# EAGLE design Isolated-ARD (EAGLE 6.3)

## Sheet 1 of 5: Voltage/Signal Input
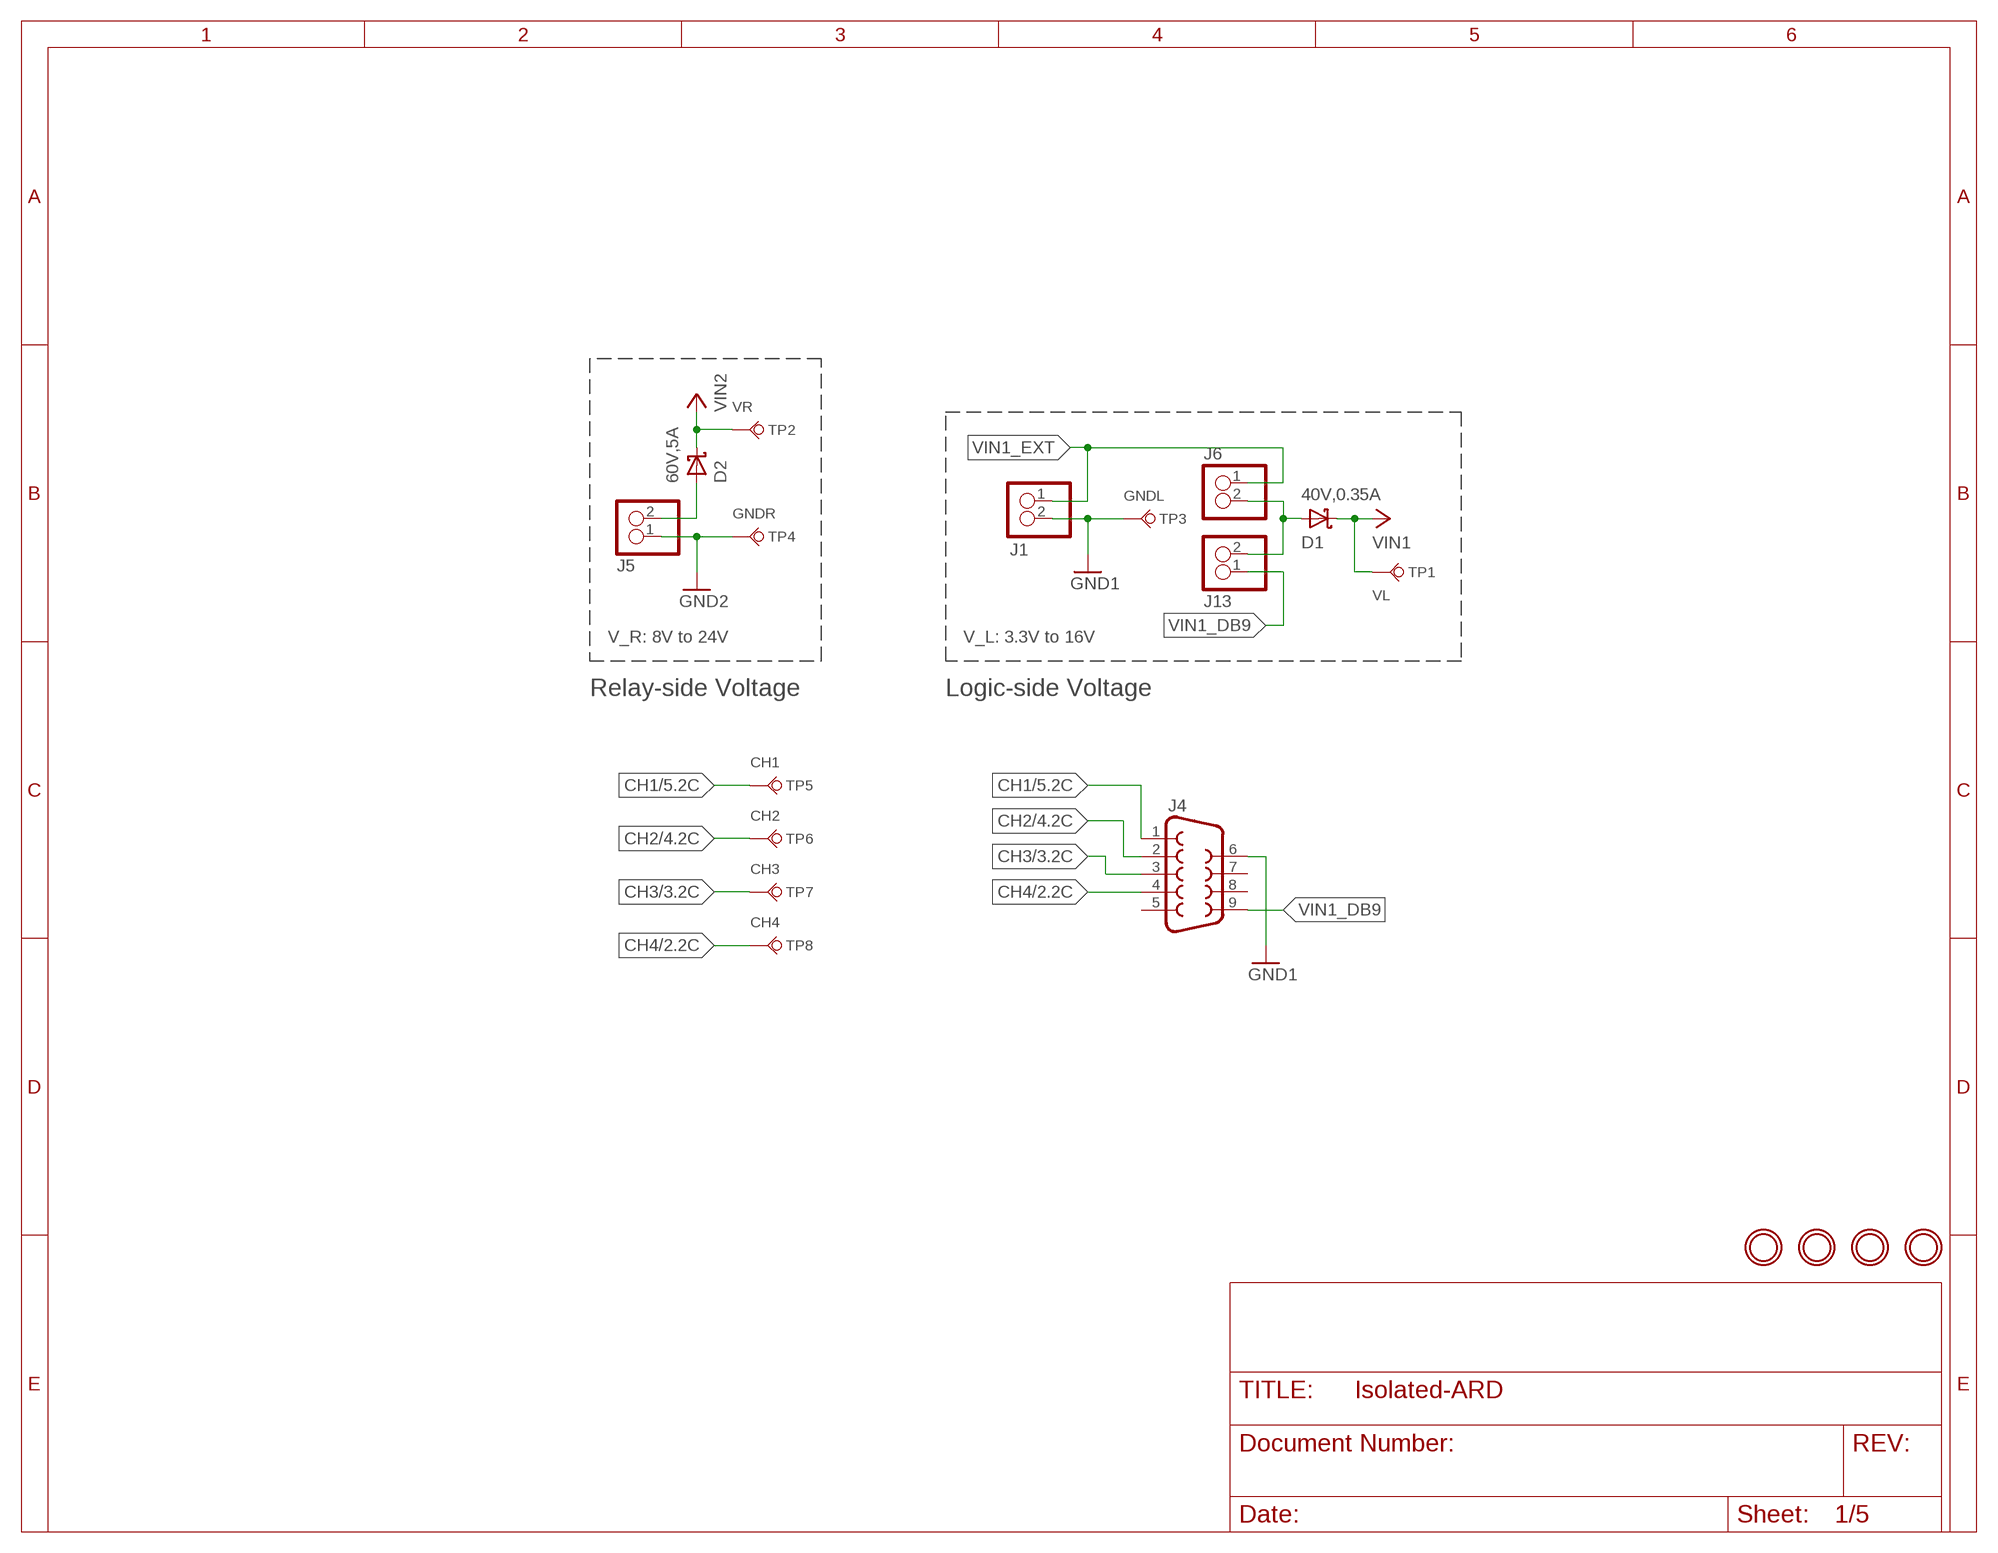
[diagram p0: schematic, sheet 1]

### Parts
D1  40V,0.35A  SD103AWS-7-F  [SOD-323]
D2  60V,5A  B560C-13-F  [SMC-DIODE]
J1  M02SKT-3.5MM-R90  [SOCKET-3.5MM-2-R90]
J4  DB9-R90-F  [DB9-R90]
J5  M02SKT-3.5MM-R90  [SOCKET-3.5MM-2-R90]
J6  M02SQ1  [1X02_SQ1]
J13  M02SQ1  [1X02_SQ1]
TP1  TP-THRU-R  [TP_THRU_CIRC]
TP2  TP-THRU-R  [TP_THRU_CIRC]
TP3  TP-THRU-B  [TP_THRU_CIRC]
TP4  TP-THRU-B  [TP_THRU_CIRC]
TP5  TP-THRU-B  [TP_THRU_CIRC]
TP6  TP-THRU-B  [TP_THRU_CIRC]
TP7  TP-THRU-B  [TP_THRU_CIRC]
TP8  TP-THRU-B  [TP_THRU_CIRC]
U$13  MNTHOLE-M3  [MNTHOLE_M3_PLATED]
U$14  MNTHOLE-M3  [MNTHOLE_M3_PLATED]
U$15  MNTHOLE-M3  [MNTHOLE_M3_PLATED]
U$21  MNTHOLE-M3  [MNTHOLE_M3_PLATED]

### Nets
CH1: J4.1 TP5.TP ; also sheet 5
CH2: J4.2 TP6.TP ; also sheet 4
CH3: J4.3 TP7.TP ; also sheet 3
CH4: J4.4 TP8.TP ; also sheet 2
GND1: J1.2 J4.6 TP3.TP ; also sheet 2,3,4,5
GND2: J5.1 TP4.TP ; also sheet 2,3,4,5
N$9: D1.A J6.2 J13.2
VIN1: D1.C TP1.TP ; also sheet 2,3,4,5
VIN1_DB9: J4.9 J13.1
VIN1_EXT: J1.1 J6.1
VIN2: D2.C TP2.TP ; also sheet 2,3,4,5
VIN2_EXT: D2.A J5.2
Unconnected: J4.5 J4.7 J4.8

### Notes on the sheet
- V_R: 8V to 24V | V_L: 3.3V to 16V
- Relay-side Voltage | Logic-side Voltage

## Sheet 2 of 5: Channel 1
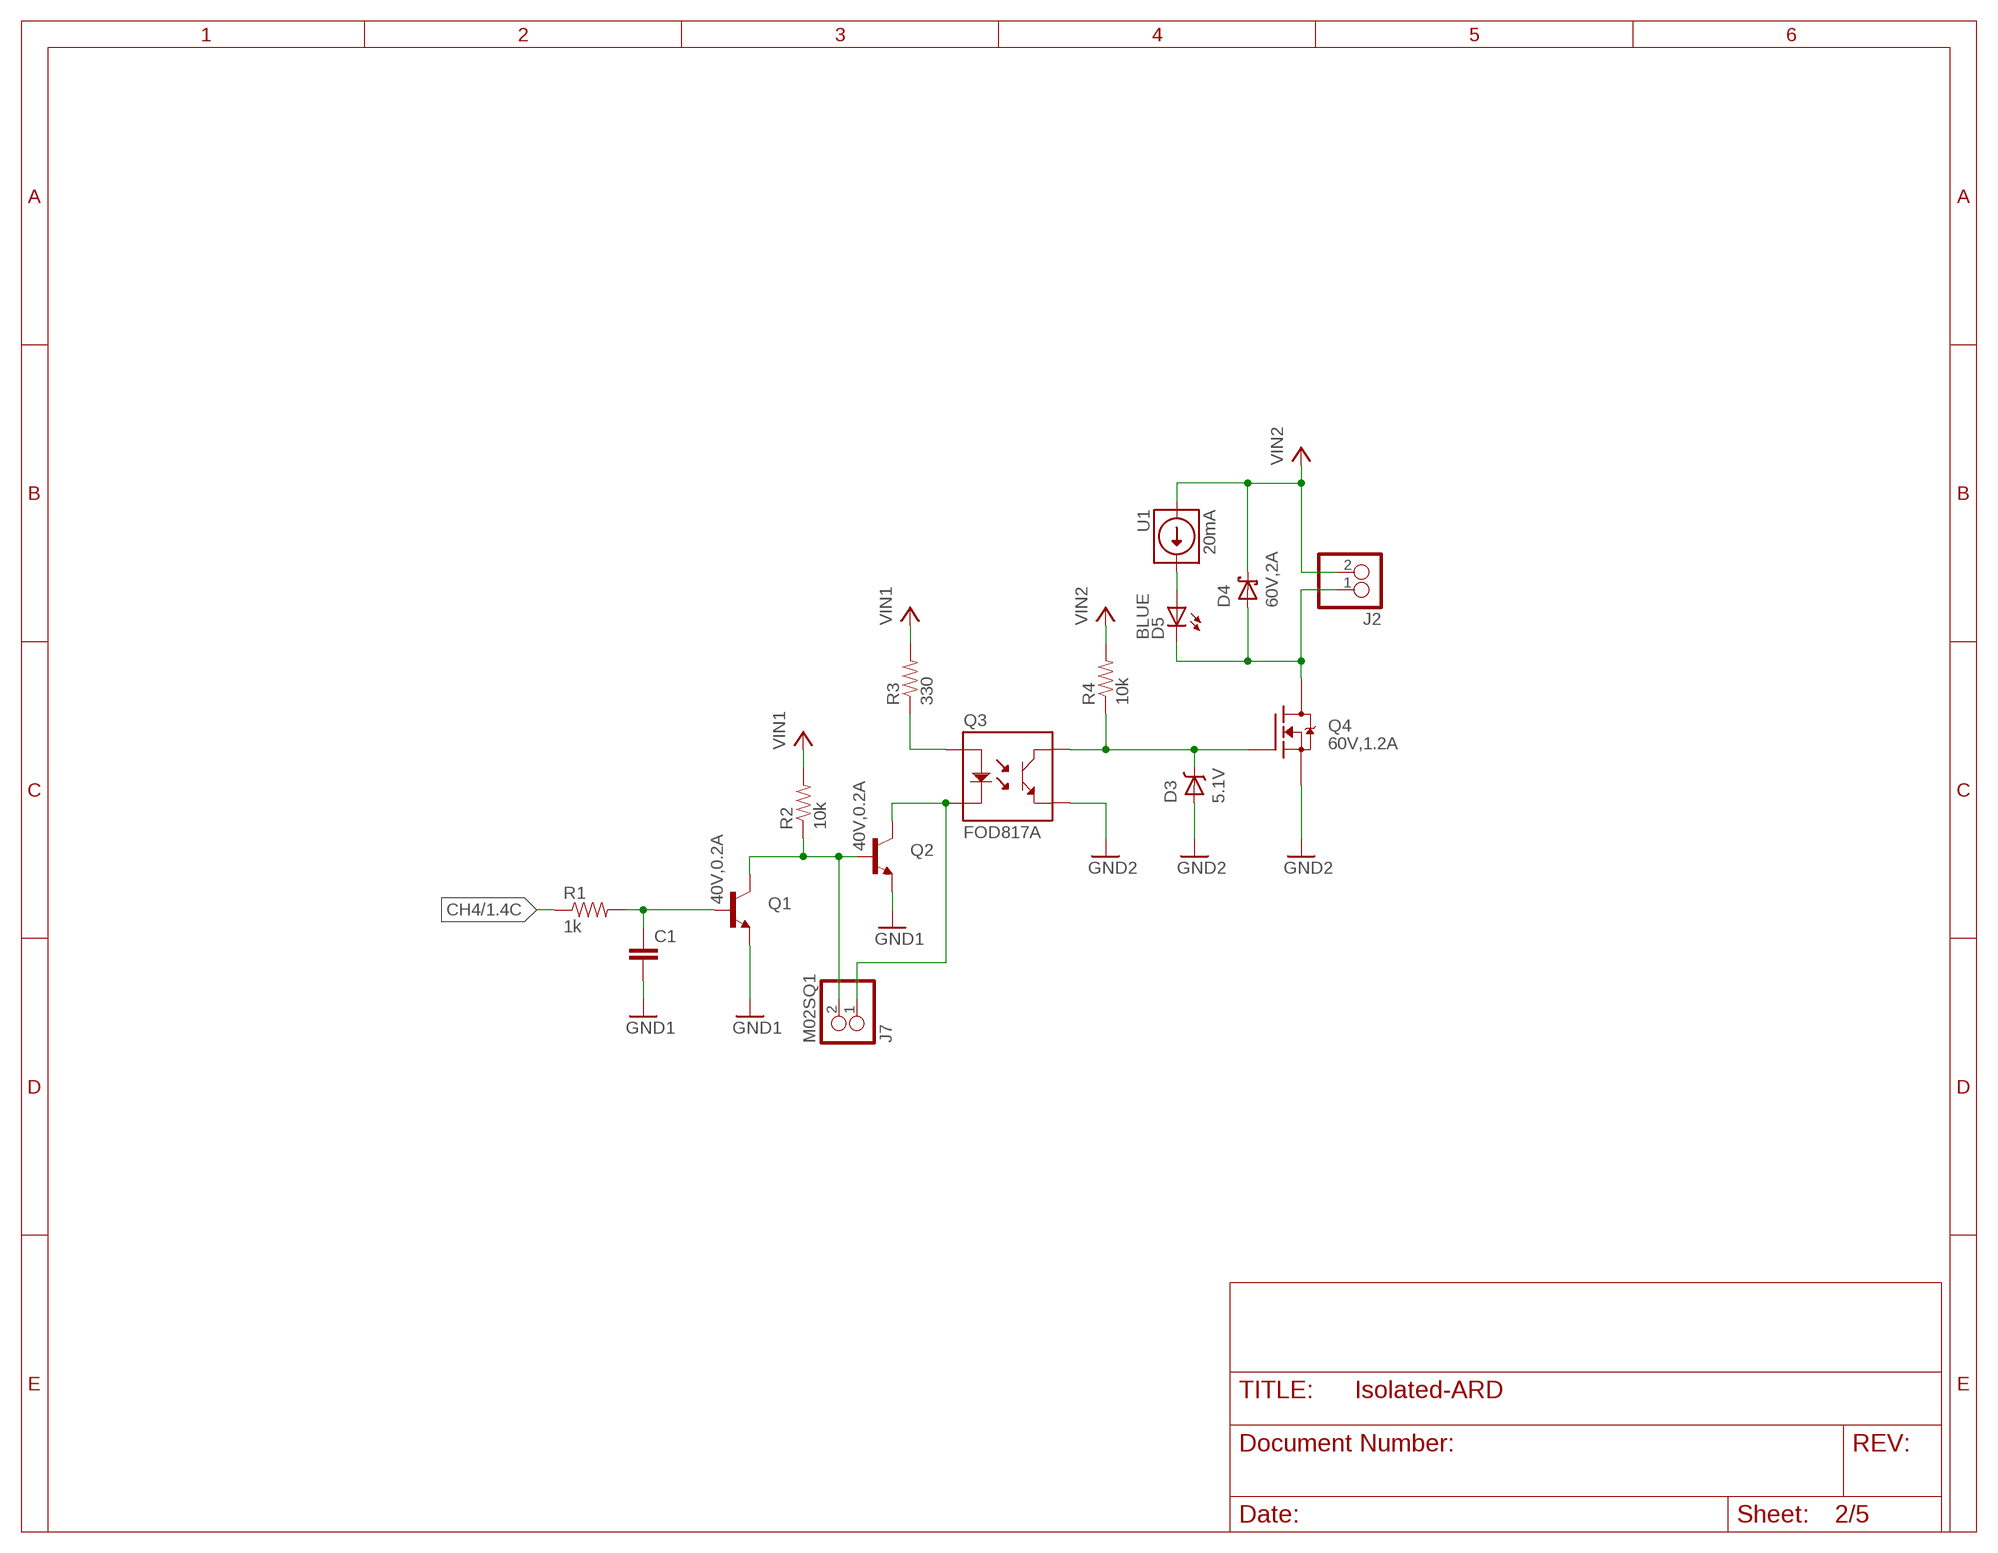
[diagram p1: schematic, sheet 2]

### Parts
C1  C-0805  [0805-CAP]
D3  5.1V  MMSZ5231B-7-F  [SOD-123]
D4  60V,2A  B260A-13-F  [SMA-DIODE]
D5  BLUE  LTST-C150KBKT  [1206-LED]
J2  M02SKT-3.5MM-R90  [SOCKET-3.5MM-2-R90]
J7  M02SQ1  [1X02_SQ1]
Q1  40V,0.2A  MMBT3904  [SOT23-3]
Q2  40V,0.2A  MMBT3904  [SOT23-3]
Q3  FOD817A  [4-SMD]
Q4  60V,1.2A  IRLML2060TRPBF  [SOT23-3]
R1  1k  1K-5%-0805  [0805-RES]
R2  10k  10K-5%-0805  [0805-RES]
R3  330  330-5%-0805  [0805-RES]
R4  10k  10K-5%-0805  [0805-RES]
U1  20mA  NSI45020T1G  [SOD-123]

### Nets
CH4: R1.P$1 ; also sheet 1
GND1: C1.P$2 Q1.2(E) Q2.2(E) ; also sheet 1,3,4,5
GND2: D3.A Q3.3(T_E) Q4.2(S) ; also sheet 1,3,4,5
N$1: J7.2 Q1.3(C) Q2.1(B) R2.P$1
N$2: J7.1 Q2.3(C) Q3.2(LED_C)
N$3: Q3.1(LED_A) R3.P$1
N$4: C1.P$1 Q1.1(B) R1.P$2
N$5: D3.C Q3.4(T_C) Q4.1(G) R4.P$1
N$6: D4.A D5.C J2.1 Q4.3(D)
N$7: D5.A U1.C
VIN1: R2.P$2 R3.P$2 ; also sheet 1,3,4,5
VIN2: D4.C J2.2 R4.P$2 U1.A ; also sheet 1,3,4,5

## Sheet 3 of 5: Channel 2
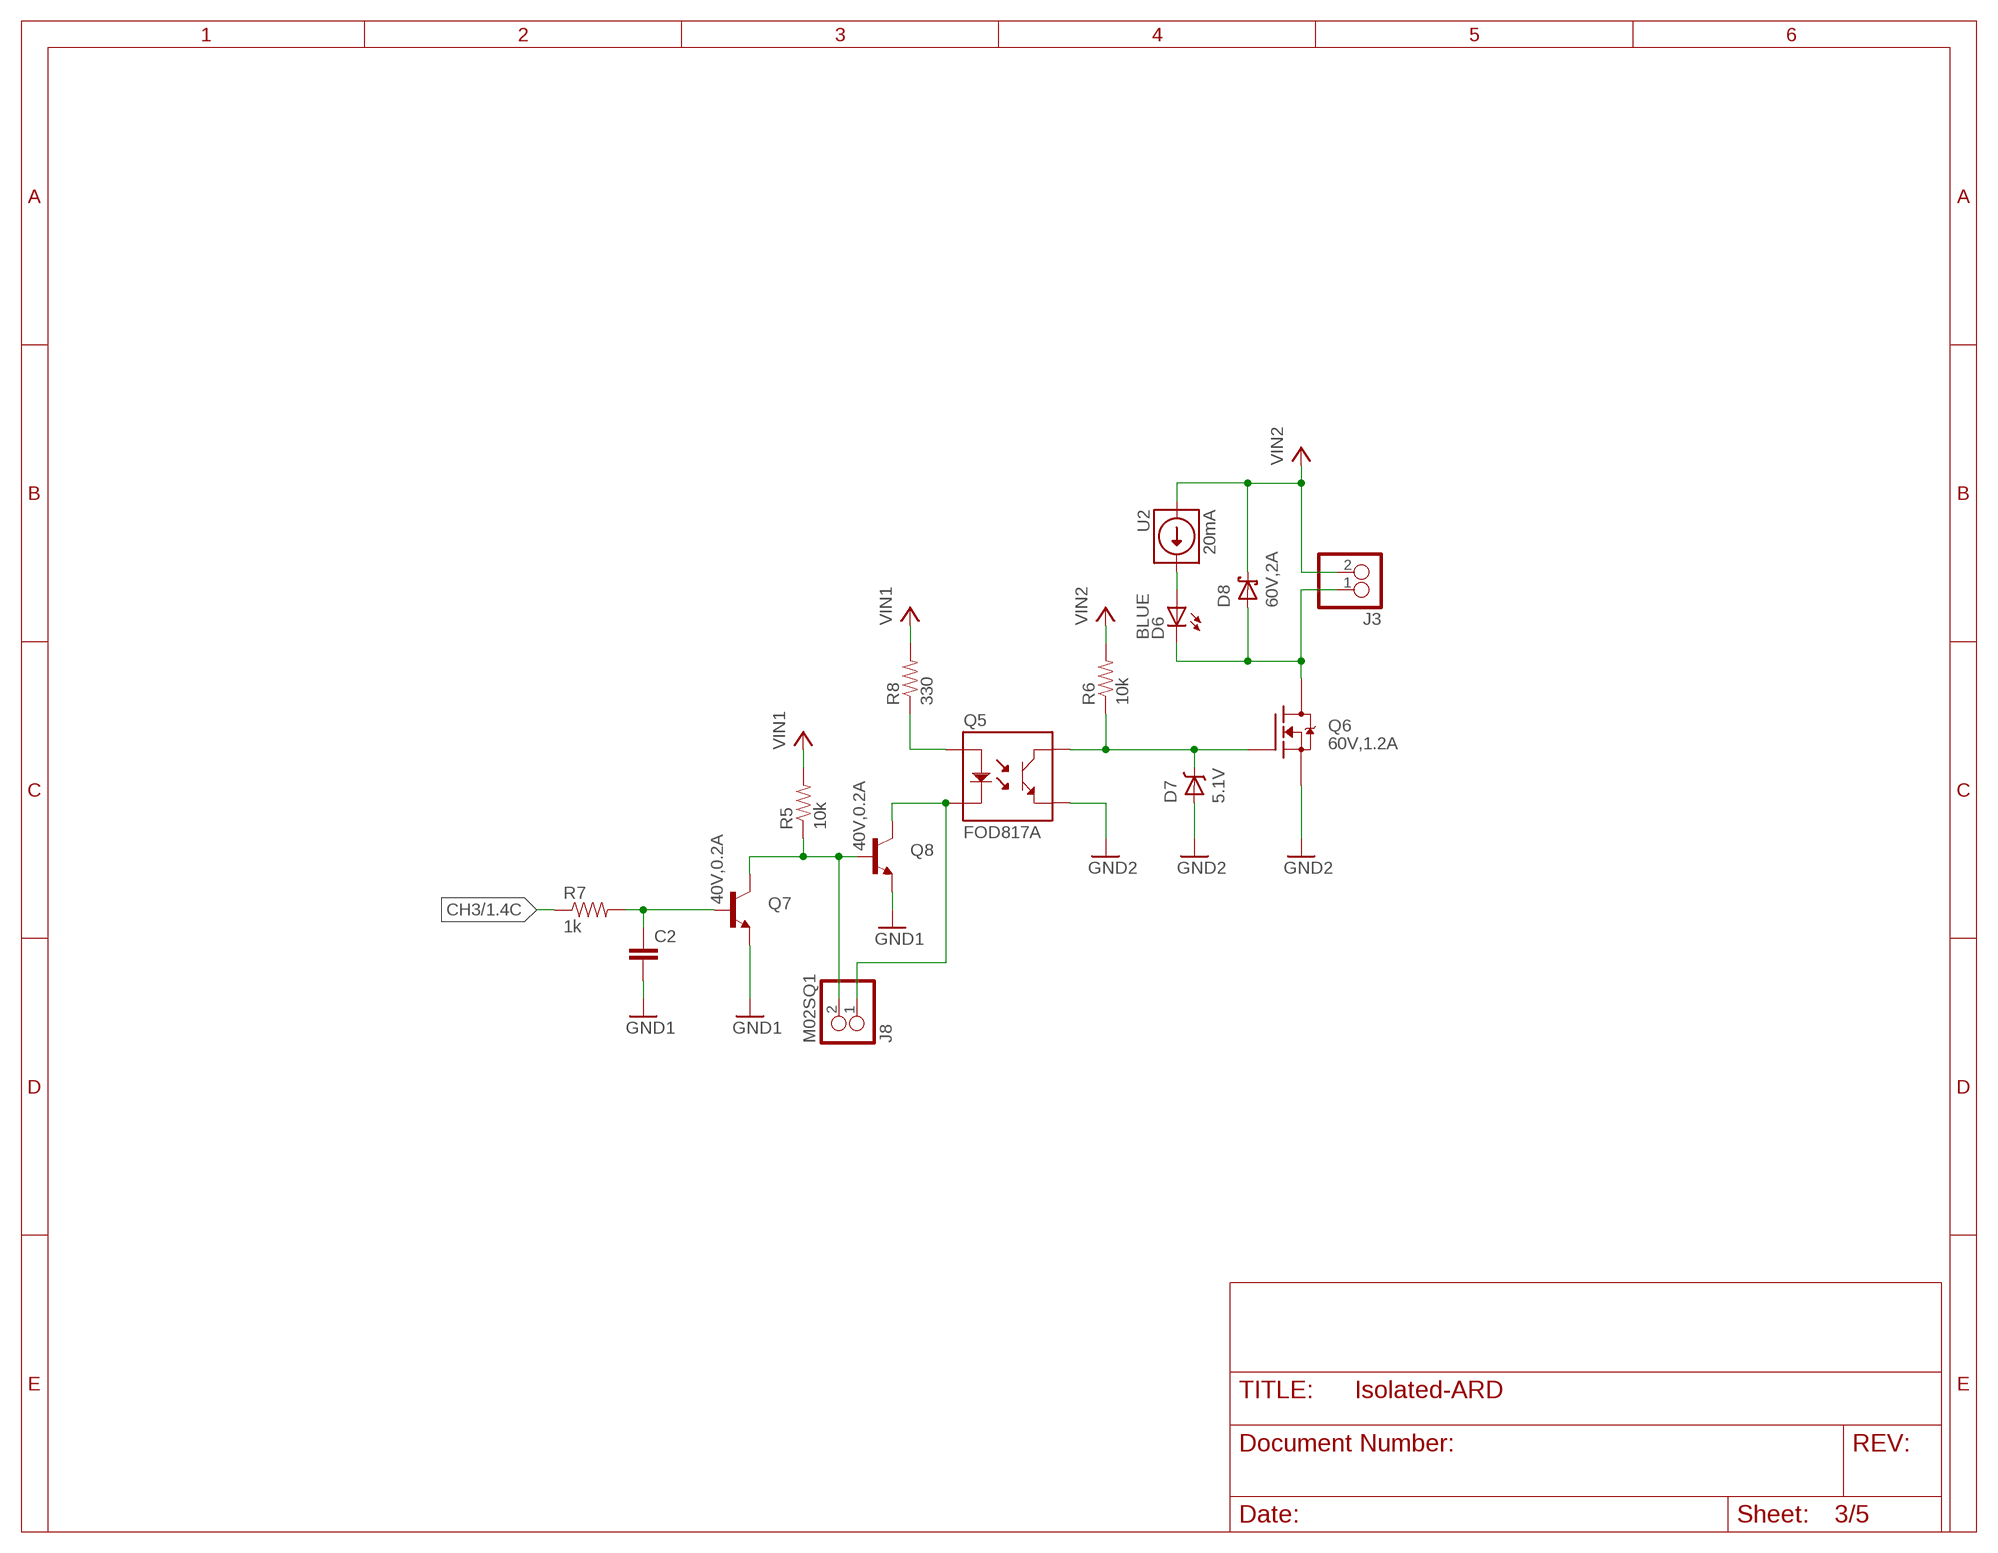
[diagram p2: schematic, sheet 3]

### Parts
C2  C-0805  [0805-CAP]
D6  BLUE  LTST-C150KBKT  [1206-LED]
D7  5.1V  MMSZ5231B-7-F  [SOD-123]
D8  60V,2A  B260A-13-F  [SMA-DIODE]
J3  M02SKT-3.5MM-R90  [SOCKET-3.5MM-2-R90]
J8  M02SQ1  [1X02_SQ1]
Q5  FOD817A  [4-SMD]
Q6  60V,1.2A  IRLML2060TRPBF  [SOT23-3]
Q7  40V,0.2A  MMBT3904  [SOT23-3]
Q8  40V,0.2A  MMBT3904  [SOT23-3]
R5  10k  10K-5%-0805  [0805-RES]
R6  10k  10K-5%-0805  [0805-RES]
R7  1k  1K-5%-0805  [0805-RES]
R8  330  330-5%-0805  [0805-RES]
U2  20mA  NSI45020T1G  [SOD-123]

### Nets
CH3: R7.P$1 ; also sheet 1
GND1: C2.P$2 Q7.2(E) Q8.2(E) ; also sheet 1,2,4,5
GND2: D7.A Q5.3(T_E) Q6.2(S) ; also sheet 1,2,4,5
N$8: J8.1 Q5.2(LED_C) Q8.3(C)
N$11: Q5.1(LED_A) R8.P$1
N$12: D7.C Q5.4(T_C) Q6.1(G) R6.P$1
N$13: J8.2 Q7.3(C) Q8.1(B) R5.P$1
N$14: C2.P$1 Q7.1(B) R7.P$2
N$15: D6.C D8.A J3.1 Q6.3(D)
N$16: D6.A U2.C
VIN1: R5.P$2 R8.P$2 ; also sheet 1,2,4,5
VIN2: D8.C J3.2 R6.P$2 U2.A ; also sheet 1,2,4,5

## Sheet 4 of 5: Channel 3
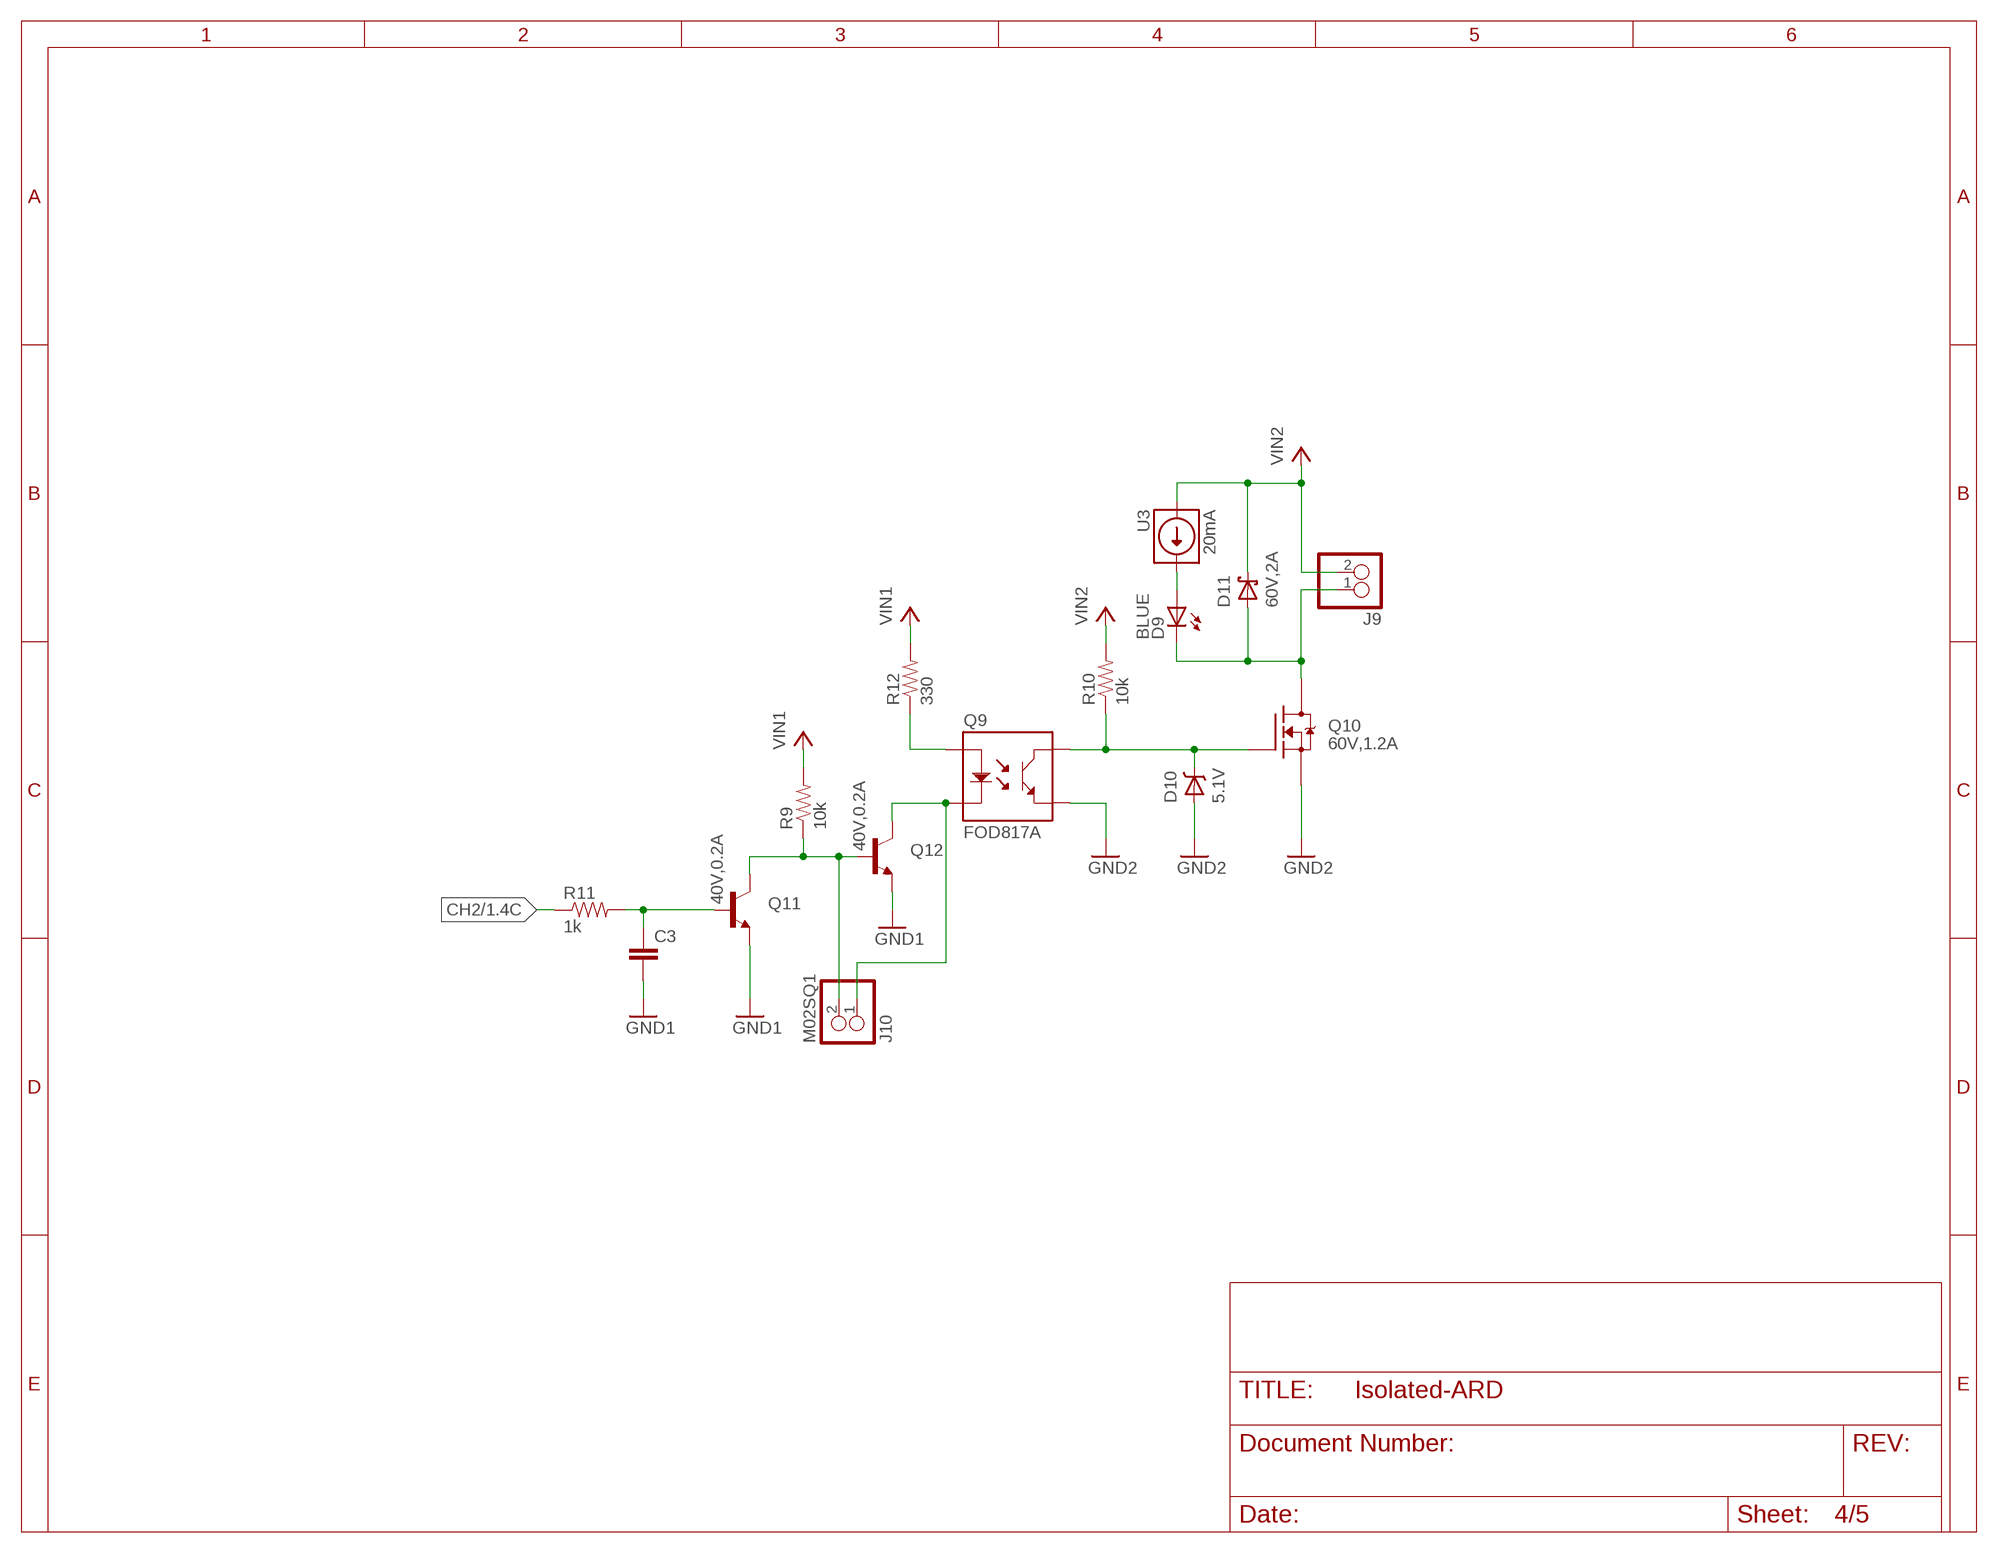
[diagram p3: schematic, sheet 4]

### Parts
C3  C-0805  [0805-CAP]
D9  BLUE  LTST-C150KBKT  [1206-LED]
D10  5.1V  MMSZ5231B-7-F  [SOD-123]
D11  60V,2A  B260A-13-F  [SMA-DIODE]
J9  M02SKT-3.5MM-R90  [SOCKET-3.5MM-2-R90]
J10  M02SQ1  [1X02_SQ1]
Q9  FOD817A  [4-SMD]
Q10  60V,1.2A  IRLML2060TRPBF  [SOT23-3]
Q11  40V,0.2A  MMBT3904  [SOT23-3]
Q12  40V,0.2A  MMBT3904  [SOT23-3]
R9  10k  10K-5%-0805  [0805-RES]
R10  10k  10K-5%-0805  [0805-RES]
R11  1k  1K-5%-0805  [0805-RES]
R12  330  330-5%-0805  [0805-RES]
U3  20mA  NSI45020T1G  [SOD-123]

### Nets
CH2: R11.P$1 ; also sheet 1
GND1: C3.P$2 Q11.2(E) Q12.2(E) ; also sheet 1,2,3,5
GND2: D10.A Q9.3(T_E) Q10.2(S) ; also sheet 1,2,3,5
N$17: J10.1 Q9.2(LED_C) Q12.3(C)
N$18: Q9.1(LED_A) R12.P$1
N$19: D10.C Q9.4(T_C) Q10.1(G) R10.P$1
N$20: J10.2 Q11.3(C) Q12.1(B) R9.P$1
N$21: C3.P$1 Q11.1(B) R11.P$2
N$22: D9.C D11.A J9.1 Q10.3(D)
N$23: D9.A U3.C
VIN1: R9.P$2 R12.P$2 ; also sheet 1,2,3,5
VIN2: D11.C J9.2 R10.P$2 U3.A ; also sheet 1,2,3,5

## Sheet 5 of 5: Channel 4
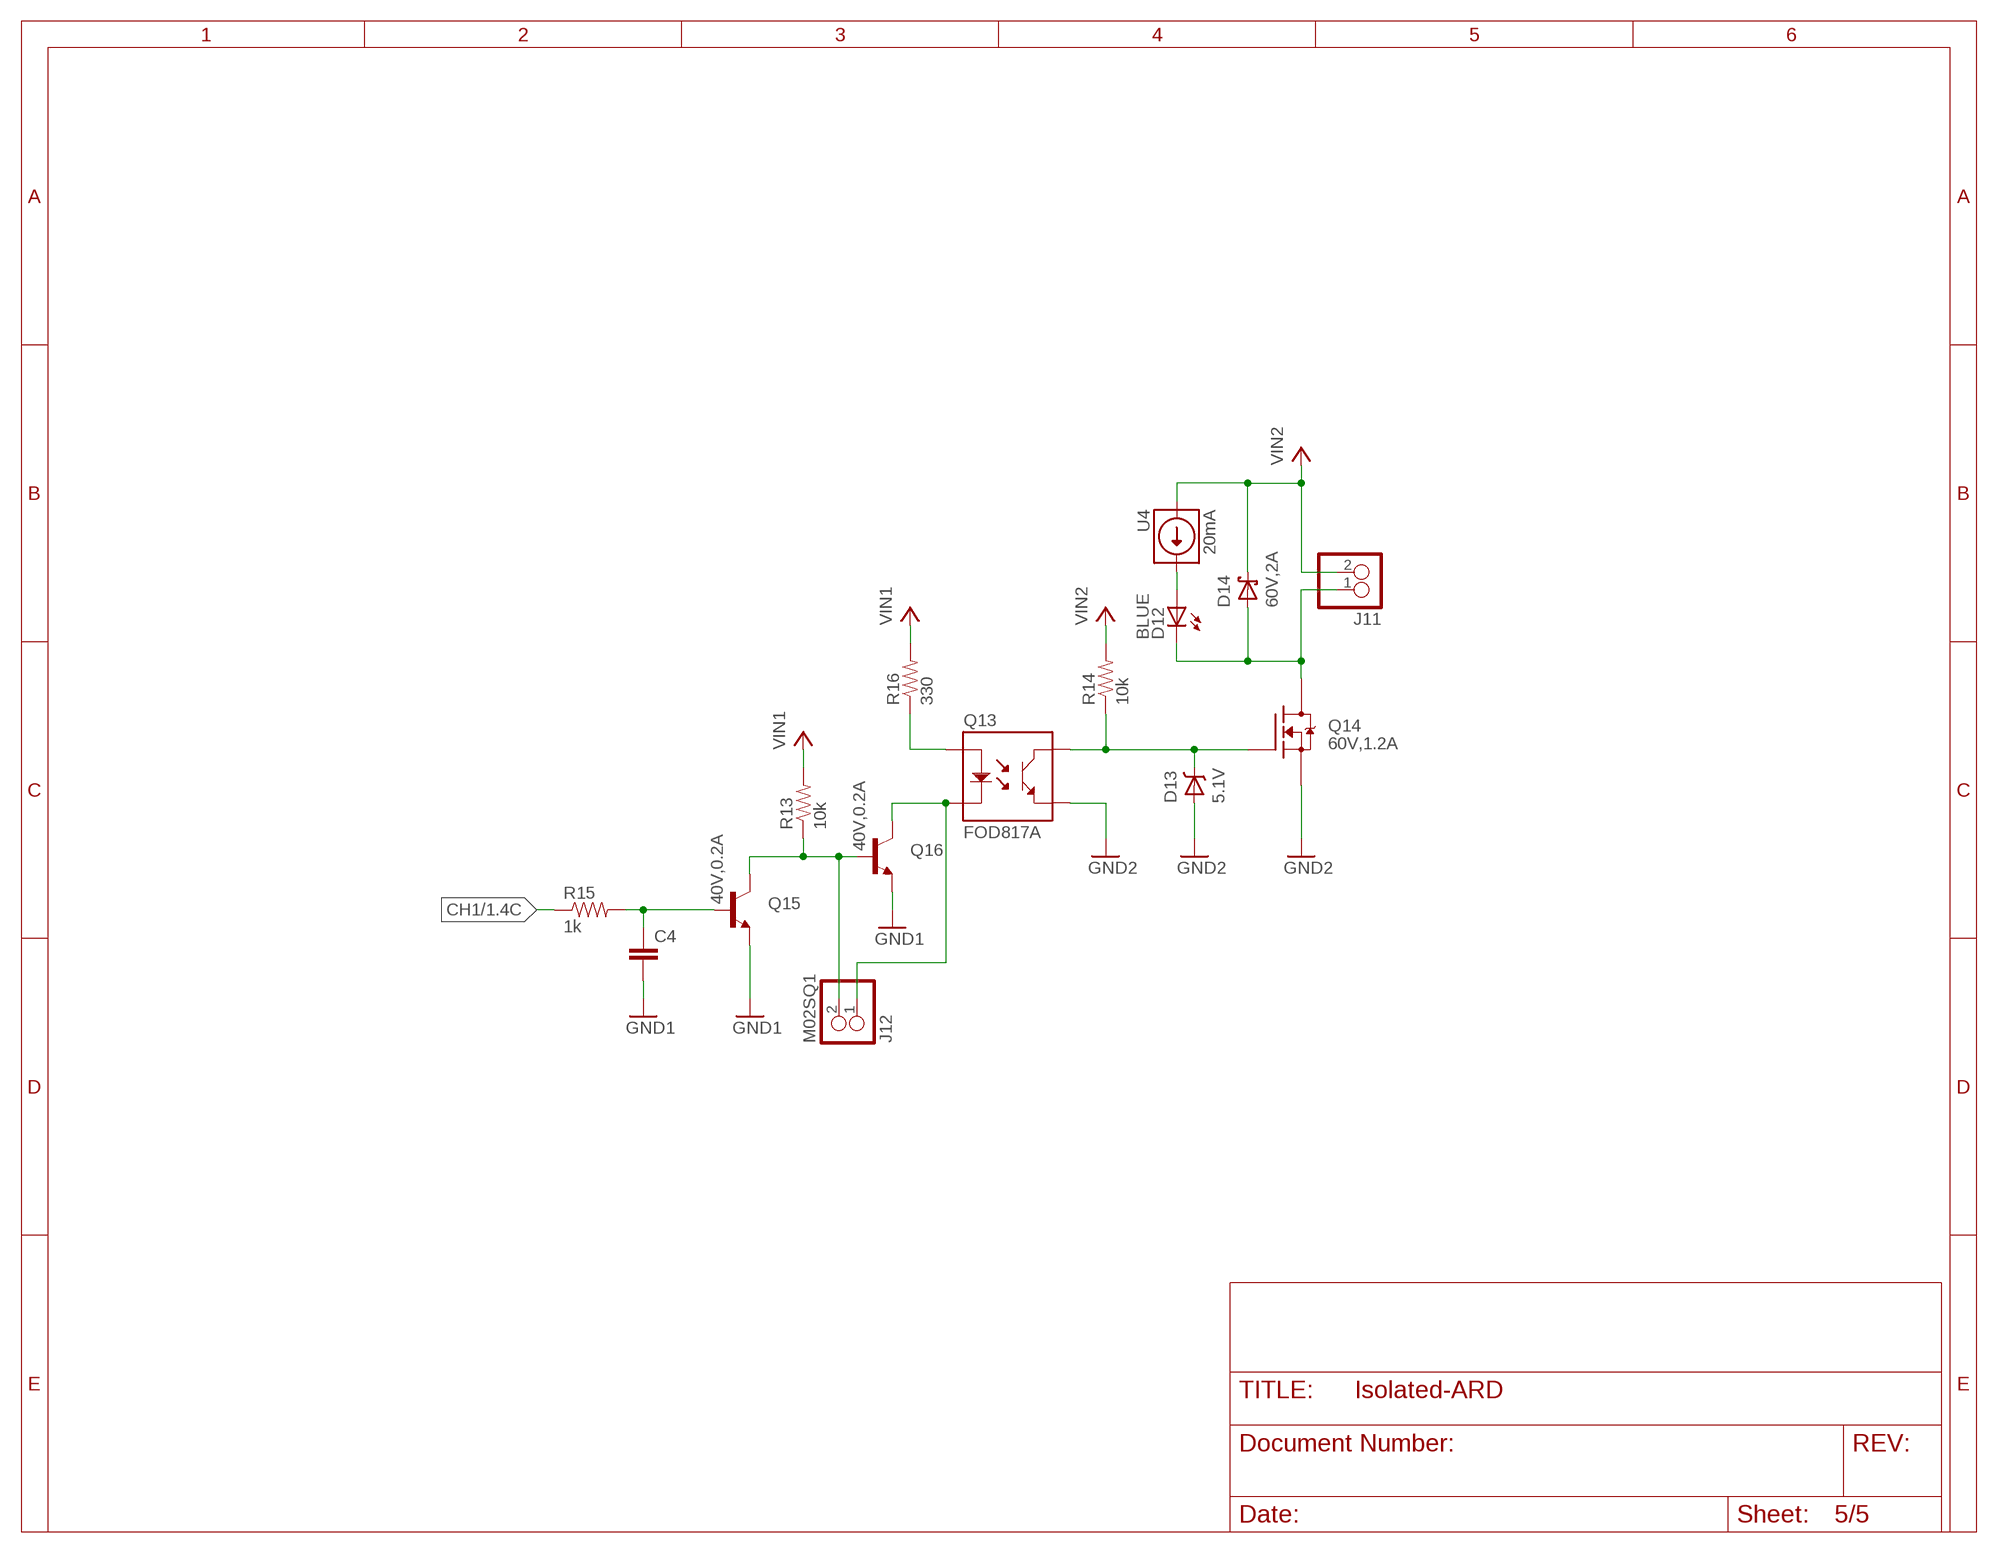
[diagram p4: schematic, sheet 5]

### Parts
C4  C-0805  [0805-CAP]
D12  BLUE  LTST-C150KBKT  [1206-LED]
D13  5.1V  MMSZ5231B-7-F  [SOD-123]
D14  60V,2A  B260A-13-F  [SMA-DIODE]
J11  M02SKT-3.5MM-R90  [SOCKET-3.5MM-2-R90]
J12  M02SQ1  [1X02_SQ1]
Q13  FOD817A  [4-SMD]
Q14  60V,1.2A  IRLML2060TRPBF  [SOT23-3]
Q15  40V,0.2A  MMBT3904  [SOT23-3]
Q16  40V,0.2A  MMBT3904  [SOT23-3]
R13  10k  10K-5%-0805  [0805-RES]
R14  10k  10K-5%-0805  [0805-RES]
R15  1k  1K-5%-0805  [0805-RES]
R16  330  330-5%-0805  [0805-RES]
U4  20mA  NSI45020T1G  [SOD-123]

### Nets
CH1: R15.P$1 ; also sheet 1
GND1: C4.P$2 Q15.2(E) Q16.2(E) ; also sheet 1,2,3,4
GND2: D13.A Q13.3(T_E) Q14.2(S) ; also sheet 1,2,3,4
N$24: J12.1 Q13.2(LED_C) Q16.3(C)
N$25: Q13.1(LED_A) R16.P$1
N$26: D13.C Q13.4(T_C) Q14.1(G) R14.P$1
N$27: J12.2 Q15.3(C) Q16.1(B) R13.P$1
N$28: C4.P$1 Q15.1(B) R15.P$2
N$29: D12.C D14.A J11.1 Q14.3(D)
N$30: D12.A U4.C
VIN1: R13.P$2 R16.P$2 ; also sheet 1,2,3,4
VIN2: D14.C J11.2 R14.P$2 U4.A ; also sheet 1,2,3,4

## Library data of the parts
C1-C4 = LoganSmith-Capacitors:C-
D1 = LoganSmith-DiscreteSemi:SD103*-7-F: Diodes Incorporated SD103* series Schottky diodes SD103AWS-SD103CWS Datasheet <http://www.diodes.com/datasheets/ds30101.pdf>; DESC: Schottky 40V 0.35A SOD323, 600mV Vf; DIGIKEY_OC: SD103AWS-FDICT-ND; MFR: Diodes Incorporated; MPN: SD103AWS-7-F; TEMP: -65C to 125C
D2 = LoganSmith-DiscreteSemi:B5*: Diodes Incorporated B5xxC* series Schottky diodes B520C-B560C Datasheet <http://www.diodes.com/datasheets/ds13012.pdf>; DESC: Schottky 60V 5A SMC, 700mV Vf; DIGIKEY_OC: B560C-FDICT-ND; MFR: Diodes Incorporated; MPN: B560C-13-F; TEMP: -55C to 125C
D3 D7 D10 D13 = LoganSmith-DiscreteSemi:MMSZ52*B?: Diodes Incorporated MMSZ52xxB series Zener MMSZ5221B-MMSZ5259B Datasheet <http://www.diodes.com/datasheets/ds18010.pdf>; DESC: Zener 5.1V 500mW SOD123, 900mV Vf; DIGIKEY_OC: MMSZ5231B-FDICT-ND; MFR: Diodes Incorporated; MPN: MMSZ5231B-7-F; TEMP: -65C to 150C
D4 D8 D11 D14 = LoganSmith-DiscreteSemi:B2*: Diodes Incorporated B2xx* series Schottky diodes B220/A-B260/A Datasheet <http://www.diodes.com/datasheets/ds13004.pdf>; DESC: Schottky 60V 2A SMA, 700mV Vf; DIGIKEY_OC: B260A-FDICT-ND; MFR: Diodes Incorporated; MPN: B260A-13-F; TEMP: -65C to 150C
D5 D6 D9 D12 = LoganSmith-LED:LTST-C?K*KT: LED from Lite-On Inc. Red: 0603 Datasheet <http://optoelectronics.liteon.com/upload/download/DS-22-99-0151/S_110_LTST-C190KRKT.pdf> 0805 Datasheet <http://optoelectronics.liteon.com/upload/download/DS-22-99-0150/S_110_LTST-C170KRKT.pdf> 1206 Datasheet <http://optoelectronics.liteon.com/upload/download/DS-22-99-0149/S_110_LTST-C150KRKT.pdf> Green: 0603 Datasheet <http://optoelectronics.liteon.com/upload/download/DS22-2000-074/S_110_LTST-C190KGKT.pdf> 0805 Datasheet <http://optoelectronics.liteon.com/upload/download/DS22-2000-073/S_110_LTST-C170KGKT.pdf> 1206 Datasheet <http://optoelectronics.liteon.com/upload/download/DS22-2000-072/S_110_LTST-C150KGKT.pdf> Blue: 0603 Datasheet <http://optoelectronics.liteon.com/upload/download/DS-22-99-0224/S_110_LTST-C190TBKT(0630).pdf> 0805 Datasheet <http://optoelectronics.liteon.com/upload/download/DS-22-99-0226/S_110_LTST-C170TBKT.pdf> 1206 Datasheet <http://optoelectronics.liteon.com/upload/download/DS22-2000-026/S_110_LTST-C150TBKT(0630).pdf>; DESC: Clear Blue LED, 1206, 3.3V Vf, 20mA; DIGIKEY_OC: 160-1643-1-ND; HEIGHT: 1.1mm; MFR: Lite-On Inc.; MPN: LTST-C150KBKT; TEMP: -30C to 85C
J1-J3 J5 J9 J11 = LoganSmith-Connectors:M02?: 1x2 Headers; VALUE: 1x2-90
J4 = LoganSmith-Connectors:DB9-*: DB-9 connector - RS232, RS485, CAN, general use; DESC: D-Sub female, right-angle, 9 pos, gold; DIGIKEY_OC: A35107-ND; MFR: TE Connectivity; MPN: 1734354-1; VALUE: DB9
J6-J8 J10 J12 J13 = LoganSmith-Connectors:M02?: 1x2 Headers; VALUE: 1x2
Q1 Q2 Q7 Q8 Q11 Q12 Q15 Q16 = LoganSmith-DiscreteSemi:MMBT3904: 40V NPN Small Signal Transistor Datasheet <http://www.diodes.com/datasheets/ds30036.pdf>; DESC: NPN 40V 200mA SOT-23-3 350mW; DIGIKEY_OC: MMBT3904-FDICT-ND; MFR: Diodes Incorporated; MPN: MMBT3904-7-F; TEMP: -55C to 150C
Q3 Q5 Q9 Q13 = LoganSmith-DiscreteSemi:FOD817: 5kV Optoisolator, 1.2V Vf, 50mA, 70V output Datasheet <https://www.fairchildsemi.com/datasheets/FO/FOD817.pdf>; DESC: Optoisolator 5kV, Transistor Output, 1.2V Vf, 50mA If,; DIGIKEY_OC: FOD817DSDCT-ND; MFR: Fairchild Semiconductor; MPN: FOD817DSD; TEMP: -55C to 110C
Q4 Q6 Q10 Q14 = LoganSmith-DiscreteSemi:IRLML2060TRPBF: N-Channel MOSFET 60V 1.2A, HEXFET, Logic Level Gate, 1.25W Datasheet <http://www.irf.com/product-info/datasheets/data/irlml2060pbf.pdf>; DESC: MOSFET N-Channel 60V 1.2A SOT23-3 1.25W; DIGIKEY_OC: IRLML2060TRPBFCT-ND; MFR: International Rectifier; MPN: IRLML2060TRPBF; TEMP: -55C to 150C
R1 R7 R11 R15 = LoganSmith-Resistors:1K-*-?: 1k Resistor, Panasonic; DIGIKEY_OC: P1.0KACT-ND; MFR: Panasonic Electronic Components; MPN: ERJ-6GEYJ102V; POWER: 0.125W
R2 R4-R6 R9 R10 R13 R14 = LoganSmith-Resistors:10K-*-?: 10k Resistor, Panasonic; DESC: RES 10K OHM 1/8W 5% 0805 SMD; DIGIKEY_OC: P10KACT-ND; MFR: Panasonic Electronic Components; MPN: ERJ-6GEYJ103V; POWER: 0.125W
R3 R8 R12 R16 = LoganSmith-Resistors:330-*-?: 330 Resistor, Panasonic; DIGIKEY_OC: P330ACT-ND; MFR: Panasonic Electronic Components; MPN: ERJ-6GEYJ331V; POWER: 0.125W
TP1 = LoganSmith-Electromechanical:TP-?*: Test points; TP_COLOR: R; TP_SIG_NAME: VL
TP2 = LoganSmith-Electromechanical:TP-?*: Test points; TP_COLOR: R; TP_SIG_NAME: VR
TP3 = LoganSmith-Electromechanical:TP-?*: Test points; TP_COLOR: B; TP_SIG_NAME: GNDL
TP4 = LoganSmith-Electromechanical:TP-?*: Test points; TP_COLOR: B; TP_SIG_NAME: GNDR
TP5 = LoganSmith-Electromechanical:TP-?*: Test points; TP_COLOR: B; TP_SIG_NAME: CH1
TP6 = LoganSmith-Electromechanical:TP-?*: Test points; TP_COLOR: B; TP_SIG_NAME: CH2
TP7 = LoganSmith-Electromechanical:TP-?*: Test points; TP_COLOR: B; TP_SIG_NAME: CH3
TP8 = LoganSmith-Electromechanical:TP-?*: Test points; TP_COLOR: B; TP_SIG_NAME: CH4
U1-U4 = LoganSmith-DiscreteSemi:NSI45020T1G: 20mA Constant Current Driver for LED Datasheet <http://www.onsemi.com/pub_link/Collateral/NSI45020-D.PDF>; DESC: Constant Current Regulator, 45Vmax, 20mA +/-15%, SOD-123; DIGIKEY_OC: NSI45020T1GOSCT-ND; MFR: ON Semiconductor; MPN: NSI45020T1G; TEMP: -40C to 85C
U$13-U$15 U$21 = LoganSmith-Electromechanical:MNTHOLE-?

## Board
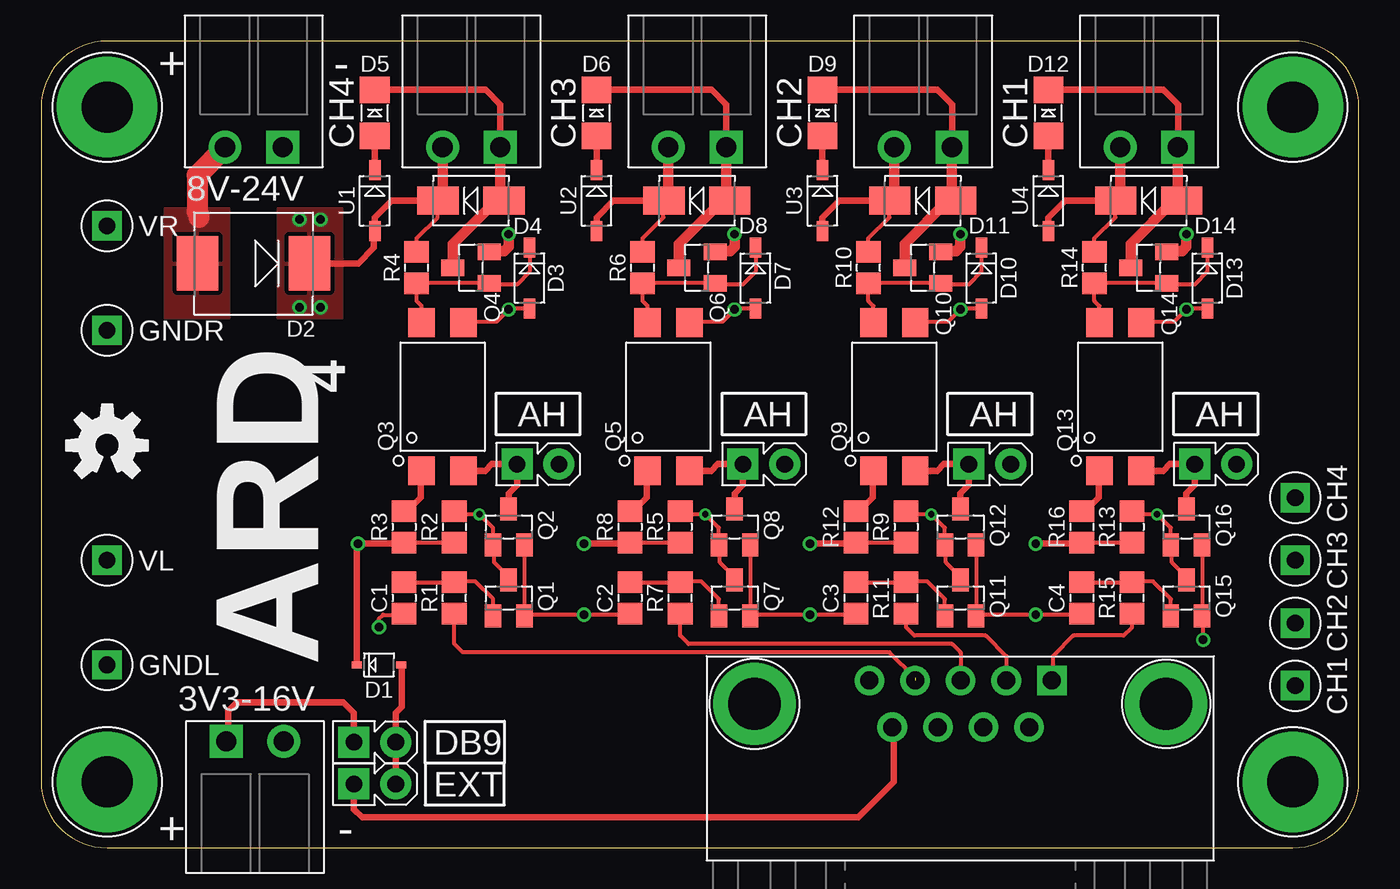
[diagram p5: board, top side]
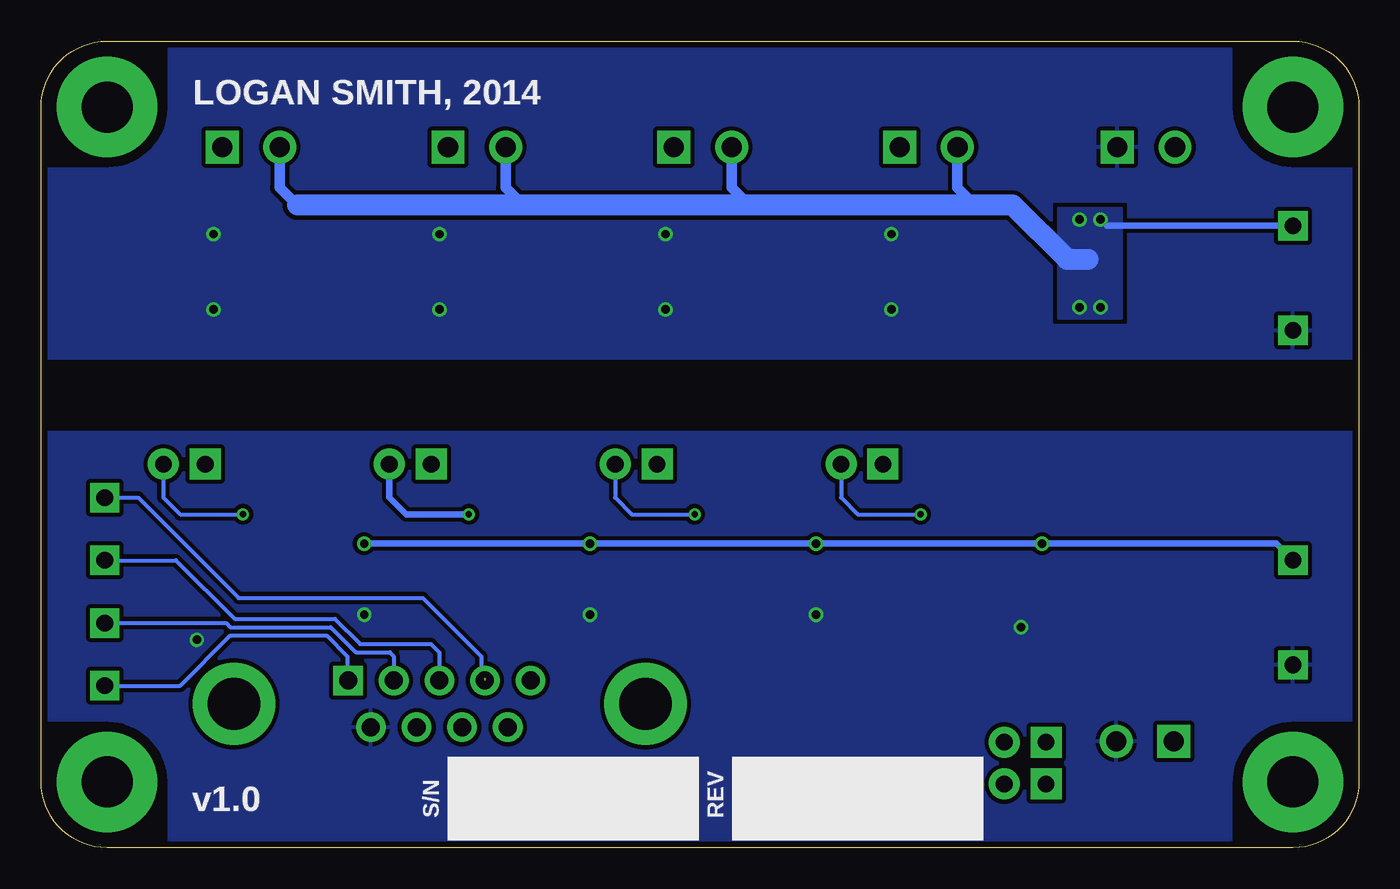
[diagram p6: board, bottom side, seen from below]

Size 80 x 49 mm. Coordinates in mm from the lower left corner, seen from the top.
Copper layers (1*16): Top 0.0356mm / dielectric 1.5011mm / Bottom 0.0356mm
Design rules "OSHPark": minimum track width 6mil, minimum drill 13mil, track to track 6mil, track to pad 6mil, pad to pad 6mil, via to via 6mil, smd to smd 6mil, copper to edge 15mil, drill to drill 6mil, minimum pad ring 7mil, minimum via ring 7mil, stop-mask expansion 3mil, vias tented up to drill 0mil, thermal gap 10mil
tRestrict: area -0.1,25.6 to 79.9,29.4
bRestrict: area -0.1,25.6 to 79.9,29.4

### Footprints (pad centres in the part's own frame; a part is rotated, then mirrored left to right if it is on the bottom)
0805-CAP = smd 1.3 x 1.5: P$1 -0.95,0; P$2 0.95,0
SOD-323 = smd 0.59 x 0.45: A -1.35,0; C 1.35,0
SMC-DIODE = smd 2.5 x 3.3: A -3.4,0; C 3.4,0
SOD-123 = smd 1.2 x 0.7: A -1.85,0; C 1.85,0
SMA-DIODE = smd 2.5 x 1.7: A -2,0; C 2,0
1206-LED = smd 1.6 x 1.8: A -1.4,0; C 1.4,0
SOCKET-3.5MM-2-R90 = drill 1.22 pad 2 square: 1 3.5,0 | drill 1.22 pad 2: 2 0,0
DB9-R90 = drill 1.09 pad 1.8 square: 1 18.06,1.42 | drill 1.09 pad 1.8: 2 15.29,1.42; 3 12.52,1.42; 4 9.75,1.42; 5 6.98,1.42; 6 16.675,-1.42; 7 13.905,-1.42; 8 11.135,-1.42; 9 8.365,-1.42 | drill 3.18 pad 5: NC$1 0,0; NC$2 24.99,0
1X02_SQ1 = drill 1.016 pad 1.88 square: 1 0,0 | drill 1.016 pad 1.88: 2 2.54,0
SOT23-3 = smd 1 x 1.4: 1 -0.95,-1.1; 2 0.95,-1.1; 3 0,1.1
4-SMD = smd 1.6 x 1.75: 1 0,0; 2 2.54,0; 3 2.54,9; 4 0,9
0805-RES = smd 1.3 x 1.5: P$1 -0.95,0; P$2 0.95,0
TP_THRU_CIRC = drill 1.016 pad 1.778 square: TP 0,0
MNTHOLE_M3_PLATED = drill 3.1 pad 6.1: P$1 0,0

### Placement (x,y rotation side)
C1  22.03,15.18 270 top
C2  35.75,15.18 270 top
C3  49.47,15.18 270 top
C4  63.18,15.18 270 top
D1  20.51,11.11 180 top
D2  12.89,35.5 0 top
D3  29.65,34.61 90 top
D4  26.1,39.31 180 top
D5  20.26,44.64 90 top
D6  33.72,44.64 90 top
D7  43.37,34.61 90 top
D8  39.81,39.31 180 top
D9  47.43,44.64 90 top
D10  57.09,34.61 90 top
D11  53.53,39.31 180 top
D12  61.15,44.64 90 top
D13  70.8,34.61 90 top
D14  67.25,39.31 180 top
J1  14.73,6.47 180 top
J2  24.37,42.55 0 top
J3  38.08,42.55 0 top
J4  43.31,8.74 0 top
J5  11.16,42.55 0 top
J6  18.99,6.41 0 top
J7  28.89,23.3 0 top
J8  42.61,23.3 0 top
J9  51.8,42.55 0 top
J10  56.32,23.3 0 top
J11  65.52,42.55 0 top
J12  70.04,23.3 0 top
J13  18.99,3.87 0 top
Q1  28.38,15.18 0 top
Q2  28.38,19.49 0 top
Q3  23.1,22.9 0 top
Q4  26.1,35.24 90 top
Q5  36.81,22.9 0 top
Q6  39.81,35.24 90 top
Q7  42.1,15.18 0 top
Q8  42.1,19.49 0 top
Q9  50.53,22.9 0 top
Q10  53.53,35.24 90 top
Q11  55.82,15.18 0 top
Q12  55.82,19.49 0 top
Q13  64.25,22.9 0 top
Q14  67.25,35.24 90 top
Q15  69.53,15.18 0 top
Q16  69.53,19.49 0 top
R1  25.08,15.18 90 top
R2  25.08,19.49 270 top
R3  22.03,19.49 270 top
R4  22.8,35.24 90 top
R5  38.8,19.49 270 top
R6  36.51,35.24 90 top
R7  38.8,15.18 90 top
R8  35.75,19.49 270 top
R9  52.51,19.49 270 top
R10  50.23,35.24 90 top
R11  52.51,15.18 90 top
R12  49.47,19.49 270 top
R13  66.23,19.49 270 top
R14  63.94,35.24 90 top
R15  66.23,15.18 90 top
R16  63.18,19.49 270 top
TP1  4,17.46 0 top
TP2  4,37.78 0 top
TP3  4,11.11 0 top
TP4  4,31.43 0 top
TP5  76.14,9.84 0 top
TP6  76.14,13.65 0 top
TP7  76.14,17.46 0 top
TP8  76.14,21.27 0 top
U1  20.26,39.31 90 top
U2  33.72,39.31 90 top
U3  47.43,39.31 90 top
U4  61.15,39.31 90 top
U$12  [DP8049_V1_PLATED]  0,0 0 top
U$13  4,4 0 top
U$14  4,45 0 top
U$15  76,45 0 top
U$16  [OSHW-LOGO-M]  4,24.45 0 top
U$21  76,4 0 top

### Tracks (layer width: path | path; a pad name or v marks a point on that pad's centre or on a via)
CH1
  Top 0.254: R15.P$1 66.23,13.4 65.72,12.89 62.67,12.89 61.4,11.62 61.4,10.2 J4.1
  Bottom 0.254: TP5.TP 71.56,9.84 68.52,12.89 62.67,12.89 61.4,11.62 61.4,10.2 J4.1
CH2
  Top 0.254: R11.P$1 52.51,13.4 53.02,12.89 57.34,12.89 58.6,11.63 J4.2
  Bottom 0.254: TP6.TP 68.77,13.65 68.52,13.4 62.42,13.4 60.9,11.87 58.84,11.87 58.6,11.63 J4.2
CH3
  Top 0.254: R7.P$1 38.8,12.89 39.31,12.38 55.31,12.38 55.83,11.86 J4.3
  Bottom 0.254: TP7.TP 71.82,17.46 68.26,13.91 62.17,13.91 60.64,12.38 56.34,12.38 55.83,11.86 J4.3
CH4  (1 unrouted)
  Top 0.254: 53.06,10.32 51.5,11.87 25.59,11.87 25.08,12.38 R1.P$1
  Bottom 0.254: TP8.TP 74.1,21.27 68.01,15.18 56.83,15.18 53.28,11.62 53.28,10.38 J4.4
GND1  (via drill 0.51)
  Top 0.254: Q2.2 Q1.2 29.42,14.16 v32.96,14.16 35.68,14.16 C2.P$2 | Q8.2 Q7.2 43.13,14.16 v46.67,14.16 49.4,14.16 C3.P$2 | Q12.2 Q11.2 56.85,14.16 v60.39,14.16 63.12,14.16 C4.P$2 | Q16.2 Q15.2 70.55,14.01 v70.55,12.64 | v20.51,13.4 20.51,13.91 20.76,14.16 21.97,14.16 C1.P$2
  pour Bottom (isolate 0.254): 79.95,25.59 79.95,4 arc-90 75.88,-0.06 3.75,-0.06 arc-90 -0.06,3.75 -0.06,25.59
GND2  (via drill 0.51)
  Top 0.254: D3.A 28.44,32.76 v28.38,32.7 27.62,31.94 25.68,31.94 Q3.3 | D7.A 42.16,32.76 v42.1,32.7 41.34,31.94 39.39,31.94 Q5.3 | D10.A 55.87,32.76 v55.82,32.7 55.05,31.94 53.11,31.94 Q9.3 | D13.A 69.59,32.76 v69.53,32.7 68.77,31.94 66.83,31.94 Q13.3 | 27.37,36.36 Q4.2 | 41.08,36.36 Q6.2 | 54.8,36.36 Q10.2 | 68.52,36.36 Q14.2
  Top 0.635: 68.26,36.28 Q14.2 68.41,36.26 69.28,36.26 69.53,36.51 v69.53,37.27 | 54.55,36.28 Q10.2 54.7,36.26 55.56,36.26 55.82,36.51 v55.82,37.27 | 40.83,36.28 Q6.2 40.98,36.26 41.85,36.26 42.1,36.51 v42.1,37.27 | 27.11,36.28 Q4.2 27.26,36.26 28.13,36.26 28.38,36.51 v28.38,37.27
  pour Bottom (isolate 0.254, rank 2): -0.06,29.4 -0.06,44.89 arc-90 4,48.96 75.88,48.96 arc-90 79.95,44.89 79.95,29.4
N$1  (via drill 0.38)
  Top 0.254: Q1.3 28.38,16.45 27.5,17.34 27.5,18.33 Q2.1 27.43,19.43 v26.61,20.26 25.27,20.26 R2.P$1
  Bottom 0.254: J7.2 31.43,21.27 30.42,20.26 v26.61,20.26
N$2
  Top 0.381: Q3.2 26.96,22.9 27.37,23.3 J7.1 28.89,22.03 28.38,21.53 Q2.3
N$3
  Top 0.381: R3.P$1 22.22,20.44 23.05,21.27 23.05,22.85 Q3.1
N$4
  Top 0.254: C1.P$1 R1.P$2 25.15,16.19 26.35,16.19 27.43,15.11 Q1.1
N$5
  Top 0.254: Q3.4 23.1,32.91 22.8,33.21 R4.P$1 Q4.1 27.26,34.23 28.89,34.23 29.65,34.99 D3.C
N$6
  Top 0.381: D5.C 26.98,46.04 27.88,45.15 27.88,42.56 J2.1
  Top 0.635: J2.1 27.87,39.54 D4.A 27.62,39.31 25,36.68 Q4.3
N$7
  Top 0.381: U1.C D5.A
N$8
  Top 0.381: Q5.2 40.68,22.9 41.08,23.3 J8.1 42.61,22.03 42.1,21.53 Q8.3
N$9
  Top 0.381: J13.2 J6.2 21.53,8.19 21.91,8.57 21.91,11.07 D1.A
N$11
  Top 0.381: R8.P$1 35.94,20.44 36.77,21.27 36.77,22.85 Q5.1
N$12
  Top 0.254: Q5.4 36.81,32.91 36.51,33.21 R6.P$1 Q6.1 40.98,34.23 42.61,34.23 43.37,34.99 D7.C
N$13  (via drill 0.38)
  Top 0.254: Q7.3 42.1,16.45 41.21,17.34 41.21,18.33 Q8.1 41.15,19.43 v40.32,20.26 38.99,20.26 R5.P$1
  Bottom 0.254: J8.2 45.15,21.27 44.13,20.26 v40.32,20.26
N$14
  Top 0.254: C2.P$1 R7.P$2 38.86,16.19 40.07,16.19 41.15,15.11 Q7.1
N$15
  Top 0.381: D6.C 40.7,46.04 41.59,45.15 41.59,42.56 J3.1
  Top 0.635: J3.1 41.58,39.54 D8.A 41.34,39.31 38.71,36.68 Q6.3
N$16
  Top 0.381: U2.C D6.A
N$17
  Top 0.381: Q9.2 54.4,22.9 54.8,23.3 J10.1 56.32,22.03 55.82,21.53 Q12.3
N$18
  Top 0.381: R12.P$1 49.65,20.44 50.48,21.27 50.48,22.85 Q9.1
N$19
  Top 0.254: Q9.4 50.53,32.91 50.23,33.21 R10.P$1 Q10.1 54.7,34.23 56.32,34.23 57.09,34.99 D10.C
N$20  (via drill 0.38)
  Top 0.254: Q11.3 55.82,16.45 54.93,17.34 54.93,18.33 Q12.1 54.87,19.43 v54.04,20.26 52.7,20.26 R9.P$1
  Bottom 0.381: J10.2 58.86,21.27 57.85,20.26 v54.04,20.26
N$21
  Top 0.254: C3.P$1 R11.P$2 52.58,16.19 53.78,16.19 54.87,15.11 Q11.1
N$22
  Top 0.381: D9.C 54.42,46.04 55.31,45.15 55.31,42.56 J9.1
  Top 0.635: J9.1 55.3,39.54 D11.A 55.05,39.31 52.43,36.68 Q10.3
N$23
  Top 0.381: U3.C D9.A
N$24
  Top 0.381: Q13.2 68.11,22.9 68.52,23.3 J12.1 70.04,22.03 69.53,21.53 Q16.3
N$25
  Top 0.381: R16.P$1 63.37,20.44 64.2,21.27 64.2,22.85 Q13.1
N$26
  Top 0.254: Q13.4 64.25,32.91 63.94,33.21 R14.P$1 Q14.1 68.41,34.23 70.04,34.23 70.8,34.99 D13.C
N$27  (via drill 0.38)
  Top 0.254: Q15.3 69.53,16.45 68.64,17.34 68.64,18.33 Q16.1 68.58,19.43 v67.75,20.26 66.42,20.26 R13.P$1
  Bottom 0.254: J12.2 72.58,21.27 71.56,20.26 v67.75,20.26
N$28
  Top 0.254: C4.P$1 R15.P$2 66.3,16.19 67.5,16.19 68.58,15.11 Q15.1
N$29
  Top 0.381: D12.C 68.13,46.04 69.02,45.15 69.02,42.56 J11.1
  Top 0.635: J11.1 69.02,39.54 D14.A 68.77,39.31 66.15,36.68 Q14.3
N$30
  Top 0.381: U4.C D12.A
VIN1  (via drill 0.51)
  Top 0.254: R3.P$2 R2.P$2 | R8.P$2 R5.P$2 | R12.P$2 R9.P$2 | R16.P$2 R13.P$2
  Top 0.381: v60.39,18.48 63.12,18.48 R16.P$2 | v46.67,18.48 49.4,18.48 R12.P$2 | v32.96,18.48 35.68,18.48 R8.P$2 | R3.P$2 21.97,18.48 v19.24,18.48 19.16,18.4 D1.C
  Bottom 0.381: v60.39,18.48 v46.67,18.48 v32.96,18.48 v19.24,18.48 5.02,18.48 TP1.TP
VIN1_DB9
  Top 0.381: J13.1 18.99,2.35 19.49,1.84 49.59,1.84 51.75,4 51.75,7.24 J4.9
VIN1_EXT
  Top 0.381: J1.1 11.37,6.6 11.37,8.32 11.87,8.83 18.35,8.83 18.99,8.19 J6.1
VIN2  (via drill 0.51)
  Top 0.254: R4.P$2 22.8,37.02 24.07,38.29 24.07,39.27 D4.C | R6.P$2 36.51,37.02 37.78,38.29 37.78,39.27 D8.C | R10.P$2 50.23,37.02 51.5,38.29 51.5,39.27 D11.C | R14.P$2 63.94,37.02 65.21,38.29 65.21,39.27 D14.C
  Top 0.381: U2.A 33.72,38.29 34.73,39.31 D8.C | U3.A 47.43,38.29 48.45,39.31 D11.C | U4.A 61.15,38.29 62.17,39.31 D14.C | U1.A 20.2,37.4 20.2,36.46 19.24,35.5 D2.C | D4.C 21.27,39.31 20.26,38.29 20.26,37.53
  Top 0.635: J2.2 24.37,39.58 D4.C | J3.2 38.08,39.58 D8.C | J9.2 51.8,39.58 D11.C 51.02,39.81 | J11.2 65.52,39.58 D14.C 64.74,39.81 | 16.95,36.16 D2.C | 15.68,36.1 D2.C | 15.68,34.89 D2.C | 16.95,34.83 D2.C
  Bottom 0.381: TP2.TP 15.3,37.78 v15.68,38.16
  Bottom 0.635: J9.2 51.8,40.12 50.74,39.05 | J11.2 65.52,40.12 64.45,39.05 | J3.2 38.08,40.12 37.02,39.05 | J2.2 24.37,40.12 23.3,39.05
  Bottom 1.27: 64.45,39.05 50.74,39.05 37.02,39.05 23.3,39.05 21.02,39.05 17.72,35.75 16.45,35.75
  other vias: 16.95,38.16 15.68,32.83 16.95,32.83
  pour Top: 14.41,32.19 14.41,38.8 18.22,38.8 18.22,32.19
  pour Bottom: 14.41,32.19 14.41,38.8 18.22,38.8 18.22,32.19
VIN2_EXT
  Top 1.27: J5.2 11.16,42.53 9.46,40.83 9.46,38.67 9.59,38.29
  pour Top: 7.56,32.19 7.56,38.8 11.37,38.8 11.37,32.19

### Text on the board
tPlace: + | - | CH4 | CH3 | CH2 | CH1 | 8V-24V | 4 | AH | AH | AH | AH | ARD | 3V3-16V | DB9 | EXT | + | -
bPlace: LOGAN SMITH, 2014 | REV | S/N | v1.0